# Altium schematic sheet MotorCtrl.SchDoc
size Letter; PageSetup: Record=PageOptions|CenterHorizontal=True|CenterVertical=True|PrintScale=0.91|XCorrection=1.00|YCorrection=1.00|PrintKind=0|BorderSize=5000000|LeftOffset=0|BottomOffset=0|Orientation=2|PaperLength=1000|PaperWidth=1000|Scale=100|PaperSource=7|PrintQuality=-4|MediaType=1|DitherType=10|PaperKind=A4|PrintScaleMode=1
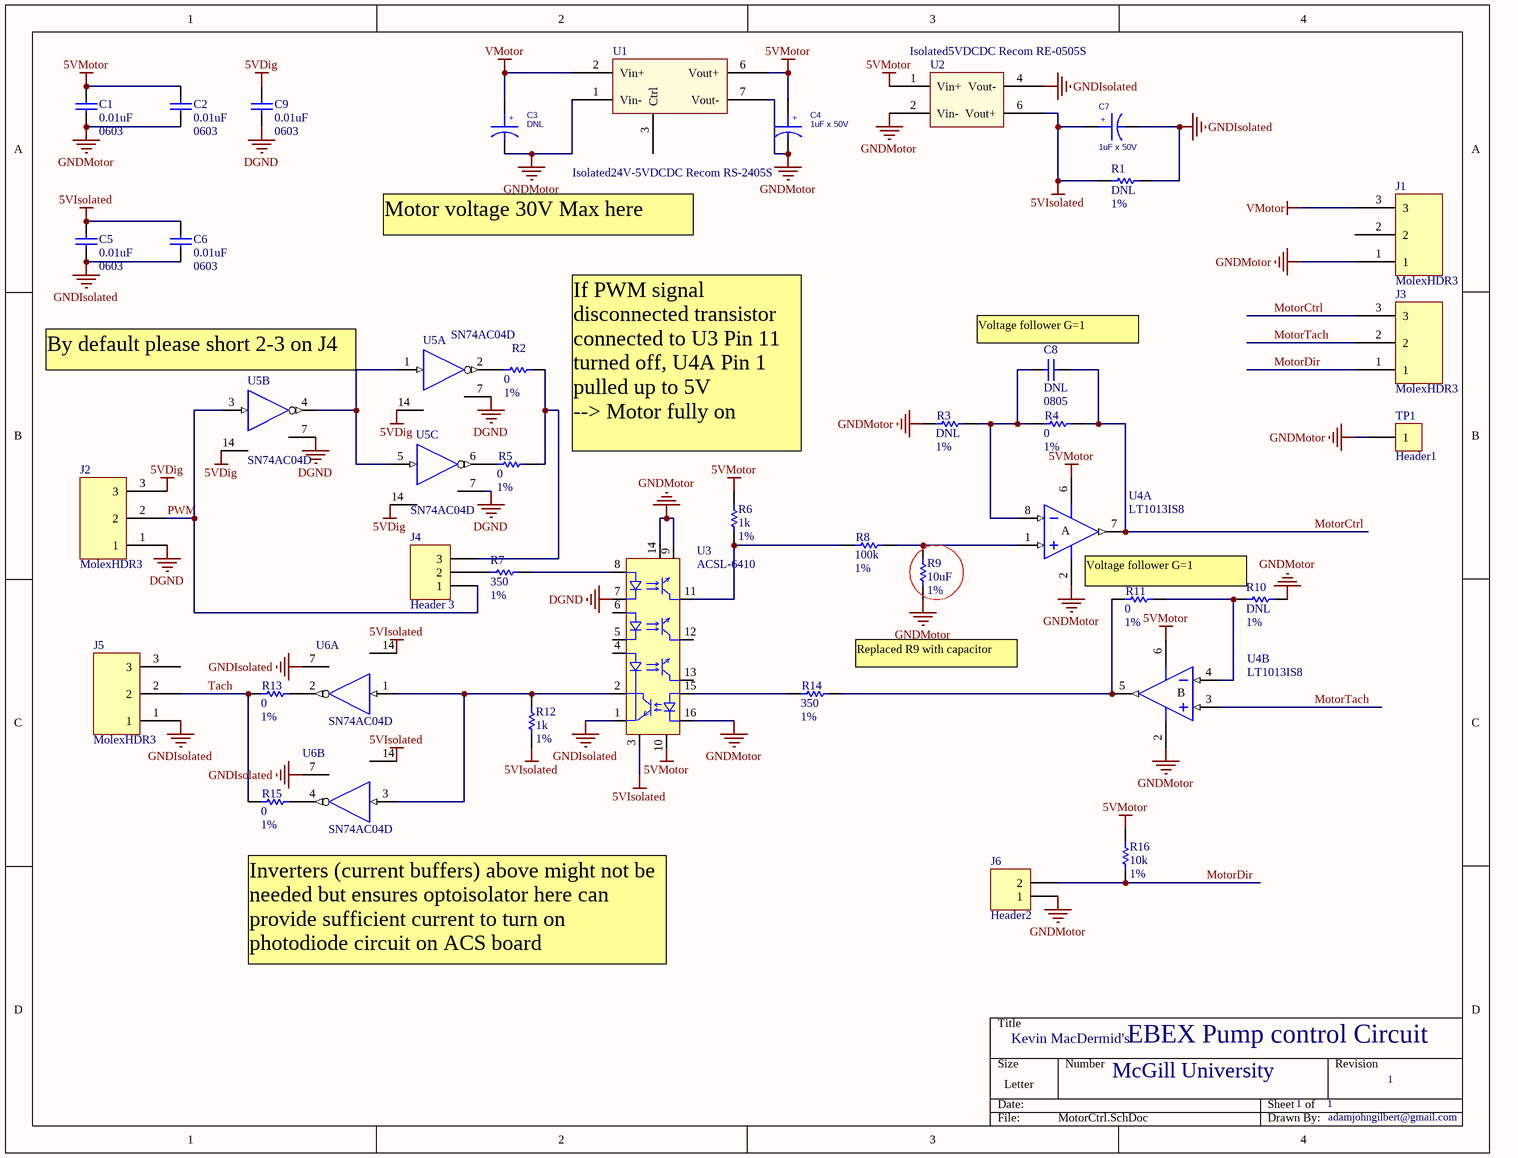
[diagram p0: MotorCtrl.SchDoc]

## Parts
C1  0.01uF  [0603]
C2  0.01uF  [0603]
C3  DNL  [TANTA]
C4  1uF x 50V  [TANTA]
C5  0.01uF  [0603]
C6  0.01uF  [0603]
C7  1uF x 50V  [TANTA]
C8  DNL  [0805]
C9  0.01uF  [0603]
J1  MolexHDR3  [HDR1X3_MolexVertical]
J2  MolexHDR3  [HDR1X3_MolexVertical]
J3  MolexHDR3  [HDR1X3_MolexVertical]
J4  Header 3  [HDR1X3]
J5  MolexHDR3  [HDR1X3_MolexVertical]
J6  Header2  [HDR1X2]
R1  value DNL  Param: 1%  [0603]  (hidden comment: Res0603)
R2  value 0  Param: 1%  [0603]  (hidden comment: Res0603)
R3  value DNL  Param: 1%  [0603]  (hidden comment: Res0603)
R4  value 0  Param: 1%  [0603]  (hidden comment: Res0603)
R5  value 0  Param: 1%  [0603]  (hidden comment: Res0603)
R6  value 1k  Param: 1%  [0603]  (hidden comment: Res0603)
R7  value 350  Param: 1%  [0603]  (hidden comment: Res0603)
R8  value 100k  Param: 1%  [0603]  (hidden comment: Res0603)
R9  value 10uF  Param: 1%  [0603]  (hidden comment: Res0603)
R10  value DNL  Param: 1%  [0603]  (hidden comment: Res0603)
R11  value 0  Param: 1%  [0603]  (hidden comment: Res0603)
R12  value 1k  Param: 1%  [0603]  (hidden comment: Res0603)
R13  value 0  Param: 1%  [0603]  (hidden comment: Res0603)
R14  value 350  Param: 1%  [0603]  (hidden comment: Res0603)
R15  value 0  Param: 1%  [0603]  (hidden comment: Res0603)
R16  value 10k  Param: 1%  [0603]  (hidden comment: Res0603)
TP1  Header1  [HDR1]
U1  Isolated24V-5VDCDC Recom RS-2405S  [RECOM_RS-2405S]
U2  Isolated5VDCDC Recom RE-0505S  [RECOM_DCDC_SIP]
U3  ACSL-6410  [SO16]
U4  LT1013IS8  [S8_N]  (parts A,B of 2)
U5  SN74AC04D  [D014_N]  (parts A,B,C of 6)
U6  SN74AC04D  [D014_N]  (parts A,B of 6)

## Nets
5VDig: C5.2 C6.2 C7.1 C9.2 J2.3 R1.1 R12.2 U2.6(Vout+) U3.3(Vcc1) U5.14(VCC) U6.14(VCC)  [also labelled 5VIsolated, VCC]
5VMotor: C1.2 C2.2 C4.1 R6.2 R16.2 U1.6(Vout+) U2.1(Vin+) U3.10(Vcc2) U4.6(V+)
DGND: C5.1 C6.1 C7.2 C9.1 J2.1 J5.1 R1.2 U2.4(Vout-) U3.1(A) U3.7(A) U5.7(GND) U6.7(GND)  [also labelled GND, GNDIsolated]
GNDMotor: C1.1 C2.1 C3.2 C4.2 J1.1 J6.1 R3.1 R9.1 R10.2 TP1.1 U1.1(Vin-) U1.7(Vout-) U2.2(Vin-) U3.9(GND) U3.14(GND) U3.16(GND) U4.2(V-)
VMotor: C3.1 J1.3 U1.2(Vin+)
MotorCtrl: C8.2 J3.3 R4.2 U4.7(OUT)
MotorDir: J3.1 J6.2 R16.1
MotorTach: J3.2 U4.3(IN+)
PWM: J2.2 J4.1 U5.3(A)
Tach: J5.2 R13.1 R15.1
NetC8_1: C8.1 R3.2 R4.1 U4.8(IN-)
NetJ4_2: J4.2 R7.2
NetJ4_3: J4.3 R2.2 R5.2
NetR2_1: R2.1 U5.2(Y)
NetR5_1: R5.1 U5.6(Y)
NetR6_1: R6.1 R8.1 U3.11(C)
NetR7_1: R7.1 U3.8(K)
NetR8_2: R8.2 R9.2 U4.1(IN+)
NetR10_1: R10.1 R11.2 U4.4(IN-)
NetR11_1: R11.1 R14.2 U4.5(OUT)
NetR12_1: R12.1 U3.2(K) U6.1(A) U6.3(A)
NetR13_2: R13.2 U6.2(Y)
NetR14_1: R14.1 U3.15(Vcc)
NetR15_2: R15.2 U6.4(Y)
NetU5_1: U5.1(A) U5.4(Y) U5.5(A)

Not connected (* = marked no-connect by the designer): J1 2; J5 3; U1 3(Ctrl) 5(NC) 8(NC); U3 4(A) 5(A) 6(K) 12(C) 13(C)

## Notes on the sheet
- Motor voltage 30V Max here
- (near U5) By default please short 2-3 on J4
- (near C8) Voltage follower G=1
- If PWM signal disconnected transistor connected to U3 Pin 11 turned off, U4A Pin 1 pulled up to 5V
  --> Motor fully on
- (near U4) Voltage follower G=1
- Replaced R9 with capacitor
- Inverters (current buffers) above might not be needed but ensures optoisolator here can provide sufficient current to turn on photodiode circuit on ACS board
- Kevin MacDermid's
- EBEX Pump control Circuit
- McGill University
- 1
- adamjohngilbert@gmail.com
- (in symbol CAP_POL) +
- (in symbol LT1013IS8, part A) A
- (in symbol LT1013IS8, part B) B

## Library data of the parts
C1 C2 C5 C6 C8 C9 = Cap0603: Capacitor, Ceramic, 0603; TechInf: *; Param1: *
C3 C4 C7 = CAP_POL: COMPFIXED: NO; COMPGROUP: 0; COMPHEIGHT: 0.000; COMPLOC: [1523.633,1584.000]; COMPROT: 90; COMPSIDE: TOP; COMPKEY: NO; COMPLOCKED: NO; DECOUPLER: NO; MEMORY: NO
J1-J3 J5 = HDR3_Molex
J4 = Header 3: Header, 0.1"  3-Pin straight
R1-R16 = Res0603: Resistor; Param1: 100ppm/C; TechInfo: *
TP1 = Header1: TestPoint1; Footprint: *; Techinf: *
U1 = Recom RS-2405S: 18-36V input, 5V output
U2 = Recom RE-0505S: Isolated 6V DC-DC
U3 = ACSL-6410: 4-Ch, Bi-Dir (3/1), 15 MBd Digital Logic Gate Optocoupler; Footprint: *; TechInf: *
U4 = LT1013IS8: Dual Precision Operational Amplifier; Note: 218; Published: 8-Jun-2000; LatestRevisionDate: 13-Apr-2006; LatestRevisionNote: IPC-7351 Footprint Added.; DatasheetVersion: Jan-1996; PackageReference: S8; Publisher: Altium Limited; PackageDescription: 8-Pin Small Outline Integrated Circuit 1.27 mm Pitch; Code_JEDEC: MS-012-AA; Code_IPC: SOIC127P600-8; ComponentLink1Description: Manufacturer Link; ComponentLink1URL: http://www.linear.com/; ComponentLink2Description: Datasheet; ComponentLink2URL: http://www.linear.com/pc/downloadDocument.do?navId=H0,C1,C1154,C1009,C1021,P1223,D3743
U5 U6 = SN74AC04D: Hex Inverter; Published: 8-Jun-2000; LatestRevisionDate: 13-Apr-2006; LatestRevisionNote: IPC-7351 Footprint Added.; DatasheetVersion: Sep-1996; PackageVersion: Jan-1998; PackageReference: D014; Publisher: Altium Limited; PackageDescription: 14-Pin Small Outline Integrated Circuit 1.27 mm Pitch; Code_IPC: SOIC127P600-14; ComponentLink1Description: Manufacturer Link; ComponentLink1URL: http://www.ti.com/; ComponentLink2Description: Datasheet; ComponentLink2URL: http://www-s.ti.com/sc/ds/sn74ac04.pdf; ComponentLink3Description: Packaging Specification; ComponentLink3URL: http://focus.ti.com/lit/ml/mpds177/mpds177.pdf
J6 = Header2: Footprint: *; Techinf: *